# EAGLE design main (EAGLE 7.2.0)
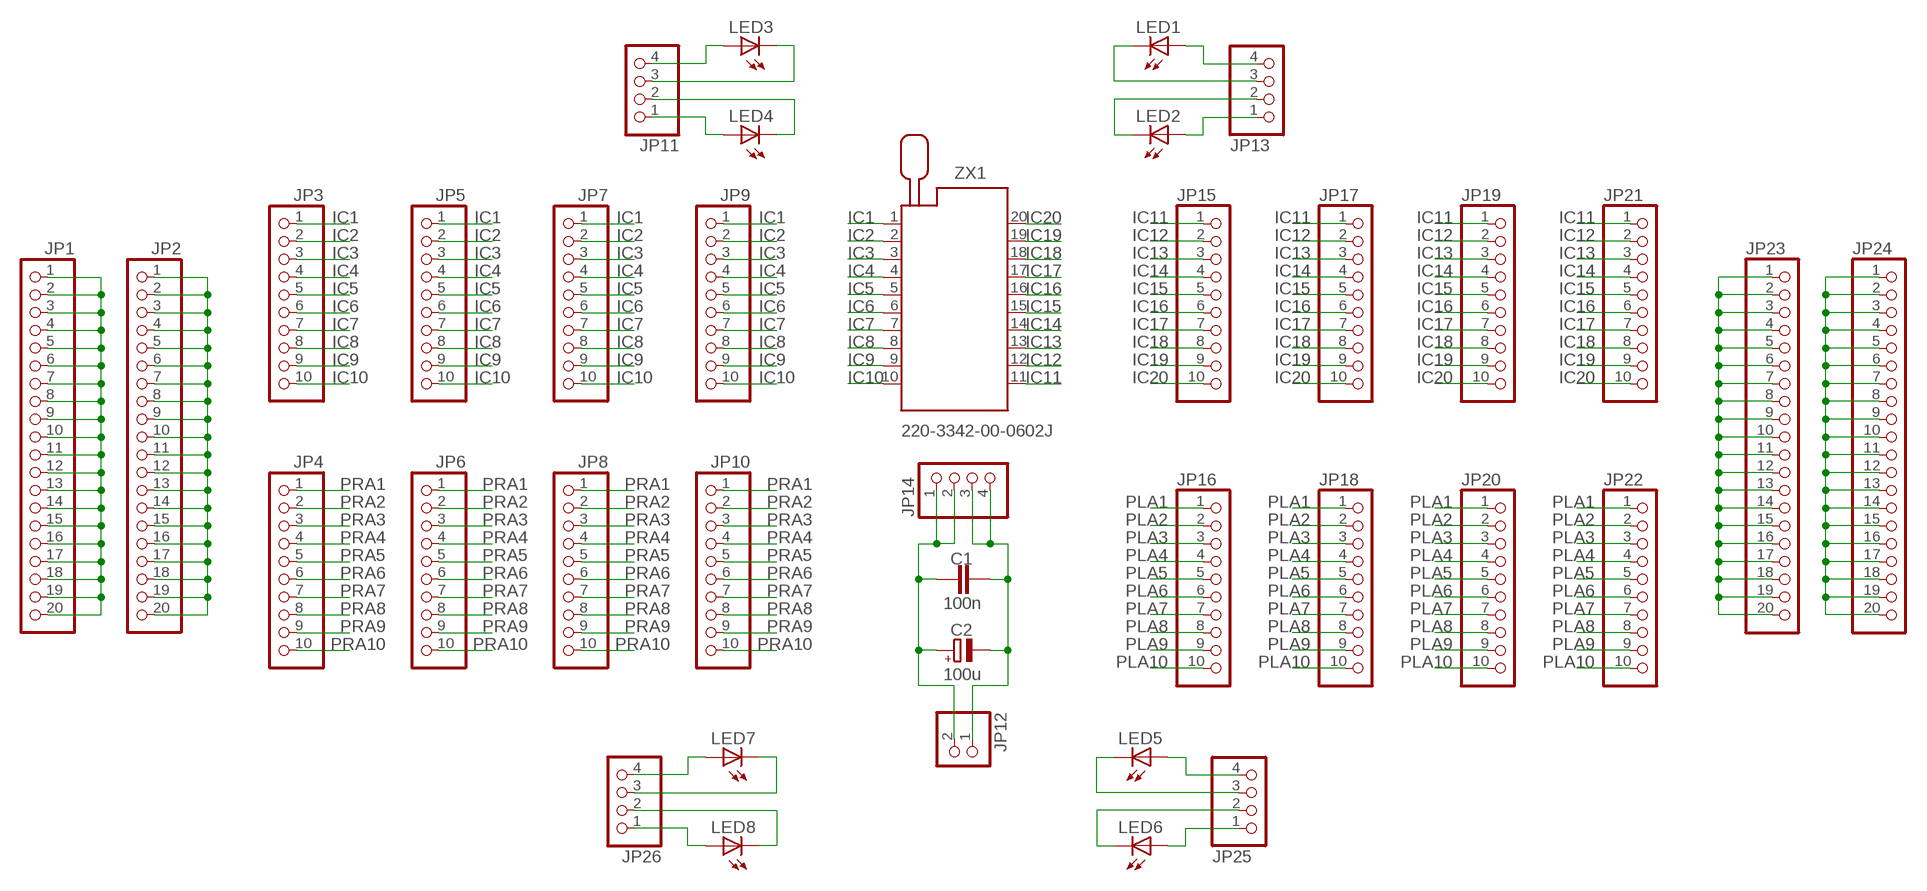
[diagram p0: schematic, sheet 1]

## Parts
C1  100n  C-EUC1206  [C1206]
C2  100u  CPOL-EUSMCA  [SMC_A]
JP1  PINHD-1X20  [1X20]
JP2  PINHD-1X20  [1X20]
JP3  PINHD-1X10  [1X10]
JP4  PINHD-1X10  [1X10]
JP5  PINHD-1X10  [1X10]
JP6  PINHD-1X10  [1X10]
JP7  PINHD-1X10  [1X10]
JP8  PINHD-1X10  [1X10]
JP9  PINHD-1X10  [1X10]
JP10  PINHD-1X10  [1X10]
JP11  PINHD-1X4  [1X04]
JP12  PINHD-1X2/90  [1X02/90]
JP13  PINHD-1X4  [1X04]
JP14  PINHD-1X4  [1X04]
JP15  PINHD-1X10  [1X10]
JP16  PINHD-1X10  [1X10]
JP17  PINHD-1X10  [1X10]
JP18  PINHD-1X10  [1X10]
JP19  PINHD-1X10  [1X10]
JP20  PINHD-1X10  [1X10]
JP21  PINHD-1X10  [1X10]
JP22  PINHD-1X10  [1X10]
JP23  PINHD-1X20  [1X20]
JP24  PINHD-1X20  [1X20]
JP25  PINHD-1X4  [1X04]
JP26  PINHD-1X4  [1X04]
LED1  LEDSFH482  [SFH482]
LED2  LEDSFH482  [SFH482]
LED3  LEDSFH482  [SFH482]
LED4  LEDSFH482  [SFH482]
LED5  LEDSFH482  [SFH482]
LED6  LEDSFH482  [SFH482]
LED7  LEDSFH482  [SFH482]
LED8  LEDSFH482  [SFH482]
ZX1  220-3342-00-0602J  [220-3342-00-0602J]

## Nets
GND: C1.2 C2.- JP12.1 JP14.3 JP14.4
IC1: JP3.1 JP5.1 JP7.1 JP9.1 ZX1.1
IC2: JP3.2 JP5.2 JP7.2 JP9.2 ZX1.2
IC3: JP3.3 JP5.3 JP7.3 JP9.3 ZX1.3
IC4: JP3.4 JP5.4 JP7.4 JP9.4 ZX1.4
IC5: JP3.5 JP5.5 JP7.5 JP9.5 ZX1.5
IC6: JP3.6 JP5.6 JP7.6 JP9.6 ZX1.6
IC7: JP3.7 JP5.7 JP7.7 JP9.7 ZX1.7
IC8: JP3.8 JP5.8 JP7.8 JP9.8 ZX1.8
IC9: JP3.9 JP5.9 JP7.9 JP9.9 ZX1.9
IC10: JP3.10 JP5.10 JP7.10 JP9.10 ZX1.10
IC11: JP15.1 JP17.1 JP19.1 JP21.1 ZX1.11
IC12: JP15.2 JP17.2 JP19.2 JP21.2 ZX1.12
IC13: JP15.3 JP17.3 JP19.3 JP21.3 ZX1.13
IC14: JP15.4 JP17.4 JP19.4 JP21.4 ZX1.14
IC15: JP15.5 JP17.5 JP19.5 JP21.5 ZX1.15
IC16: JP15.6 JP17.6 JP19.6 JP21.6 ZX1.16
IC17: JP15.7 JP17.7 JP19.7 JP21.7 ZX1.17
IC18: JP15.8 JP17.8 JP19.8 JP21.8 ZX1.18
IC19: JP15.9 JP17.9 JP19.9 JP21.9 ZX1.19
IC20: JP15.10 JP17.10 JP19.10 JP21.10 ZX1.20
N$1: JP1.1 JP1.2 JP1.3 JP1.4 JP1.5 JP1.6 JP1.7 JP1.8 JP1.9 JP1.10 JP1.11 JP1.12 JP1.13 JP1.14 JP1.15 JP1.16 JP1.17 JP1.18 JP1.19 JP1.20
N$2: JP2.1 JP2.2 JP2.3 JP2.4 JP2.5 JP2.6 JP2.7 JP2.8 JP2.9 JP2.10 JP2.11 JP2.12 JP2.13 JP2.14 JP2.15 JP2.16 JP2.17 JP2.18 JP2.19 JP2.20
N$3: JP24.1 JP24.2 JP24.3 JP24.4 JP24.5 JP24.6 JP24.7 JP24.8 JP24.9 JP24.10 JP24.11 JP24.12 JP24.13 JP24.14 JP24.15 JP24.16 JP24.17 JP24.18 JP24.19 JP24.20
N$4: JP23.1 JP23.2 JP23.3 JP23.4 JP23.5 JP23.6 JP23.7 JP23.8 JP23.9 JP23.10 JP23.11 JP23.12 JP23.13 JP23.14 JP23.15 JP23.16 JP23.17 JP23.18 JP23.19 JP23.20
N$5: JP13.3 LED1.K(C)
N$6: JP13.4 LED1.A
N$7: JP13.2 LED2.K(C)
N$8: JP13.1 LED2.A
N$9: JP11.3 LED3.K(C)
N$10: JP11.4 LED3.A
N$11: JP11.2 LED4.K(C)
N$12: JP11.1 LED4.A
N$14: JP25.3 LED5.K(C)
N$16: JP25.4 LED5.A
N$17: JP25.2 LED6.K(C)
N$18: JP25.1 LED6.A
N$19: JP26.3 LED7.K(C)
N$20: JP26.4 LED7.A
N$21: JP26.2 LED8.K(C)
N$22: JP26.1 LED8.A
PLA1: JP16.1 JP18.1 JP20.1 JP22.1
PLA2: JP16.2 JP18.2 JP20.2 JP22.2
PLA3: JP16.3 JP18.3 JP20.3 JP22.3
PLA4: JP16.4 JP18.4 JP20.4 JP22.4
PLA5: JP16.5 JP18.5 JP20.5 JP22.5
PLA6: JP16.6 JP18.6 JP20.6 JP22.6
PLA7: JP16.7 JP18.7 JP20.7 JP22.7
PLA8: JP16.8 JP18.8 JP20.8 JP22.8
PLA9: JP16.9 JP18.9 JP20.9 JP22.9
PLA10: JP16.10 JP18.10 JP20.10 JP22.10
PRA1: JP4.1 JP6.1 JP8.1 JP10.1
PRA2: JP4.2 JP6.2 JP8.2 JP10.2
PRA3: JP4.3 JP6.3 JP8.3 JP10.3
PRA4: JP4.4 JP6.4 JP8.4 JP10.4
PRA5: JP4.5 JP6.5 JP8.5 JP10.5
PRA6: JP4.6 JP6.6 JP8.6 JP10.6
PRA7: JP4.7 JP6.7 JP8.7 JP10.7
PRA8: JP4.8 JP6.8 JP8.8 JP10.8
PRA9: JP4.9 JP6.9 JP8.9 JP10.9
PRA10: JP4.10 JP6.10 JP8.10 JP10.10
VCC: C1.1 C2.+ JP12.2 JP14.1 JP14.2

## Library data of the parts
C1 = resistor:C-EU: CAPACITOR, European symbol
C2 = resistor:CPOL-EU: POLARIZED CAPACITOR, European symbol
JP1 JP2 JP23 JP24 = pinhead:PINHD-1X20: PIN HEADER
JP3-JP10 JP15-JP22 = pinhead:PINHD-1X10: PIN HEADER
JP11 JP13 JP14 JP25 JP26 = pinhead:PINHD-1X4: PIN HEADER
JP12 = pinhead:PINHD-1X2: PIN HEADER
LED1-LED8 = led:LED: LED OSRAM: - CHIPLED LG R971, LG N971, LY N971, LG Q971, LY Q971, LO R971, LY R971 LH N974, LH R974 LS Q976, LO Q976, LY Q976 LO Q996 - Hyper CHIPLED LW Q18S LB Q993, LB Q99A, LB R99A - SideLED LS A670, LO A670, LY A670, LG A670, LP A670 LB A673, LV A673, LT A673, LW A673 LH A674 LY A675 LS A676, LA A676, LO A676, LY A676, LW A676 LS A679, LY A679, LG A679 - Hyper Micro SIDELED® LS Y876, LA Y876, LO Y876, LY Y876 LT Y87S - SmartLED LW L88C, LW L88S LB L89C, LB L89S, LG L890 LS L89K, LO L89K, LY L89K LS L896, LA L896, LO L896, LY L896 - TOPLED LS T670, LO T670, LY T670, LG T670, LP T670 LSG T670, LSP T670, LSY T670, LOP T670, LYG T670 LG T671, LOG T671, LSG T671 LB T673, LV T673, LT T673, LW T673 LH T674 LS T676, LA T676, LO T676, LY T676, LB T676, LH T676, LSB T676, LW T676 LB T67C, LV T67C, LT T67C, LS T67K, LO T67K, LY T67K, LW E67C LS E67B, LA E67B, LO E67B, LY E67B, LB E67C, LV E67C, LT E67C LW T67C LS T679, LY T679, LG T679 LS T770, LO T770, LY T770, LG T770, LP T770 LB T773, LV T773, LT T773, LW T773 LH T774 LS E675, LA E675, LY E675, LS T675 LS T776, LA T776, LO T776, LY T776, LB T776 LHGB T686 LT T68C, LB T68C - Hyper Mini TOPLED® LB M676 - Mini TOPLED Santana® LG M470 LS M47K, LO M47K, LY M47K Source: http://www.osram.convergy.de LUXEON: - LUMILED® LXK2-PW12-R00, LXK2-PW12-S00, LXK2-PW14-U00, LXK2-PW14-V00 LXK2-PM12-R00, LXK2-PM12-S00, LXK2-PM14-U00 LXK2-PE12-Q00, LXK2-PE12-R00, LXK2-PE12-S00, LXK2-PE14-T00, LXK2-PE14-U00 LXK2-PB12-K00, LXK2-PB12-L00, LXK2-PB12-M00, LXK2-PB14-N00, LXK2-PB14-P00, LXK2-PB14-Q00 LXK2-PR12-L00, LXK2-PR12-M00, LXK2-PR14-Q00, LXK2-PR14-R00 LXK2-PD12-Q00, LXK2-PD12-R00, LXK2-PD12-S00 LXK2-PH12-R00, LXK2-PH12-S00 LXK2-PL12-P00, LXK2-PL12-Q00, LXK2-PL12-R00 Source: www.luxeon.com KINGBRIGHT: KA-3528ASYC Source: www.kingbright.com
ZX1 = con-3m:220-3342-00-0602J: Zero Insertion Force Socked Source: http://www.3M.com/ehpd; MF: 3M; MPN: 220-3342-00-0602J; OC_FARNELL: 9897445; OC_NEWARK: 85K7807

## Board
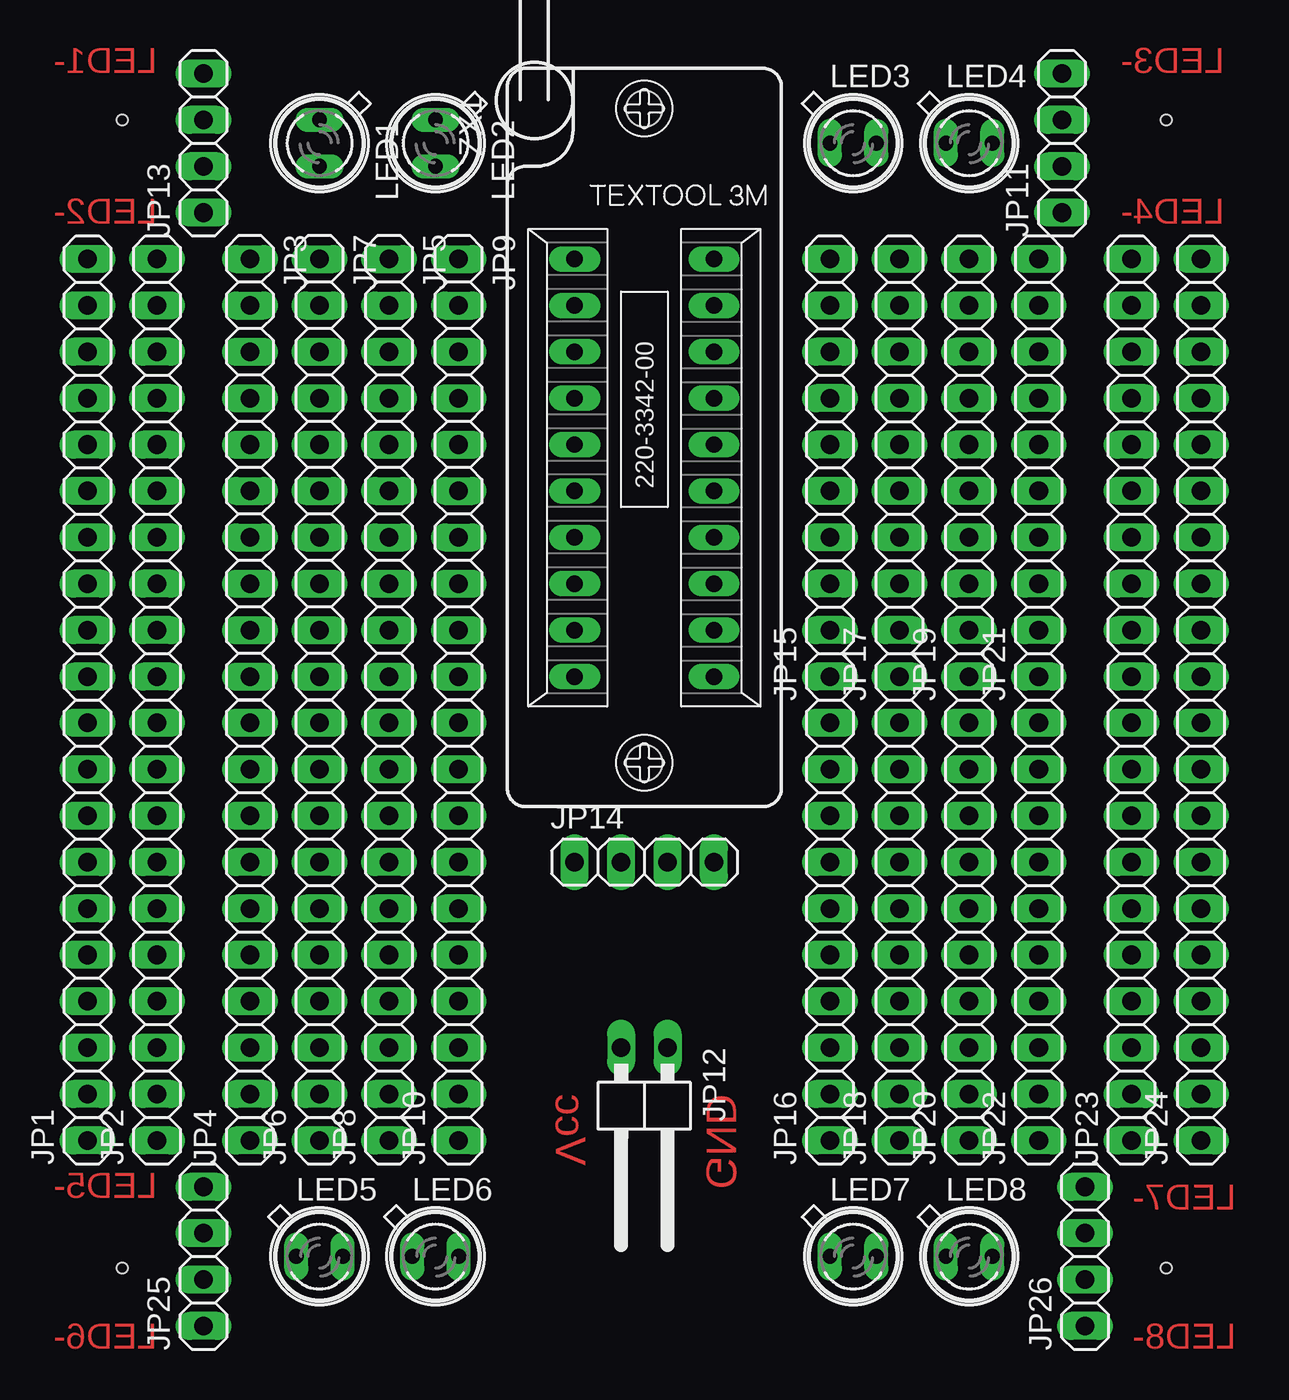
[diagram p1: board, top side]
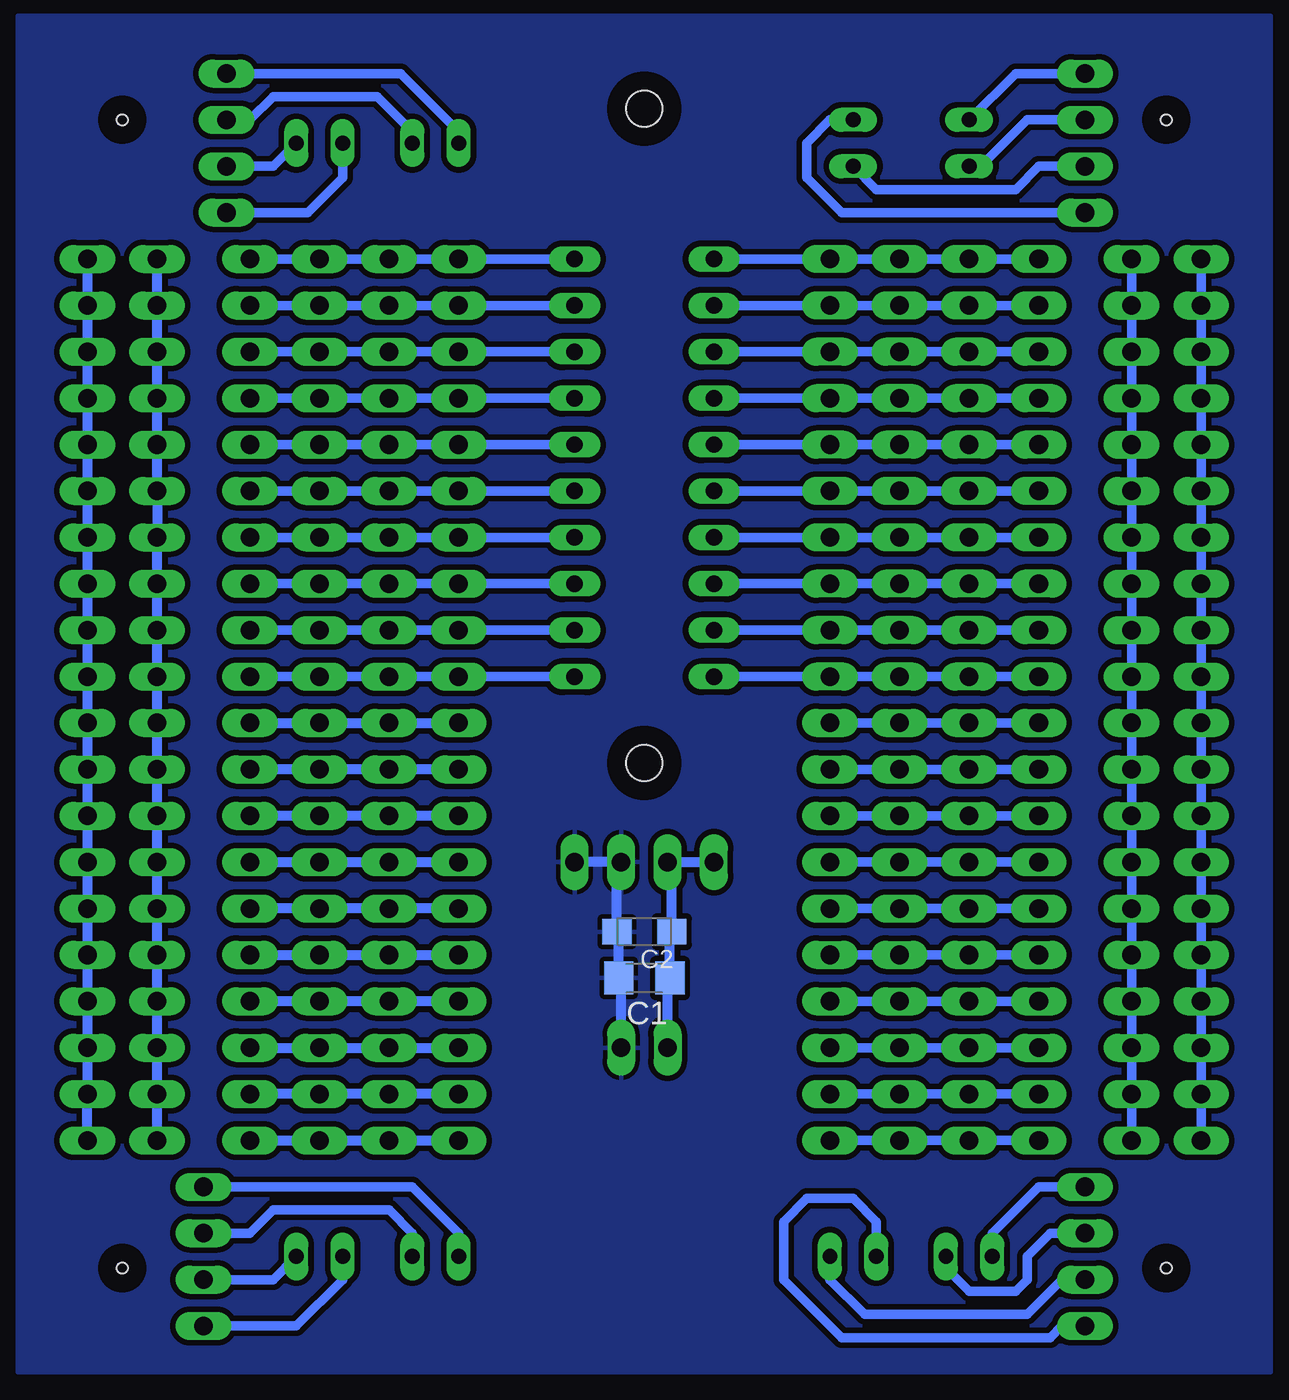
[diagram p2: board, bottom side, seen from below]

No outline drawn. Coordinates in mm, seen from the top.
Copper layers (1*16): Top 0.035mm / dielectric 1.5mm / Bottom 0.035mm
Design rules "default *": minimum track width 10mil, minimum drill 24mil, track to track 12mil, track to pad 10mil, pad to pad 8mil, via to via 8mil, smd to smd 8mil, copper to edge 40mil, drill to drill 8mil, minimum pad ring 10mil, minimum via ring 8mil, stop-mask expansion 4mil, vias tented up to drill 0mil, thermal gap 10mil
Holes 0.6 mm at 5.71,68.58 62.87,68.58 62.87,5.71 5.71,5.71

### Footprints (pad centres in the part's own frame; a part is rotated, then mirrored left to right if it is on the bottom)
C1206 = smd 1.6 x 1.8: 1 -1.4,0; 2 1.4,0
SMC_A = smd 1.6 x 1.4: + -1.5,0; - 1.5,0
1X20 = drill 1.016 long: 1 -24.13,0; 2 -21.59,0; 3 -19.05,0; 4 -16.51,0; 5 -13.97,0; 6 -11.43,0; 7 -8.89,0; 8 -6.35,0; 9 -3.81,0; 10 -1.27,0; 11 1.27,0; 12 3.81,0; 13 6.35,0; 14 8.89,0; 15 11.43,0; 16 13.97,0; 17 16.51,0; 18 19.05,0; 19 21.59,0; 20 24.13,0
1X10 = drill 1.016 long: 1 -11.43,0; 2 -8.89,0; 3 -6.35,0; 4 -3.81,0; 5 -1.27,0; 6 1.27,0; 7 3.81,0; 8 6.35,0; 9 8.89,0; 10 11.43,0
1X04 = drill 1.016 long: 1 -3.81,0; 2 -1.27,0; 3 1.27,0; 4 3.81,0
1X02/90 = drill 1.016 long: 1 -1.27,-3.81; 2 1.27,-3.81
SFH482 = drill 0.813 long: A -1.27,0; K 1.27,0
220-3342-00-0602J = drill 0.9 long: 1 -11.43,-3.81; 2 -8.89,-3.81; 3 -6.35,-3.81; 4 -3.81,-3.81; 5 -1.27,-3.81; 6 1.27,-3.81; 7 3.81,-3.81; 8 6.35,-3.81; 9 8.89,-3.81; 10 11.43,-3.81; 11 11.43,3.81; 12 8.89,3.81; 13 6.35,3.81; 14 3.81,3.81; 15 1.27,3.81; 16 -1.27,3.81; 17 -3.81,3.81; 18 -6.35,3.81; 19 -8.89,3.81; 20 -11.43,3.81 | hole 2: 16.16,0; -19.66,0

### Placement (x,y rotation side)
C1  34.29,21.59 180 bottom
C2  34.29,24.13 180 bottom
JP1  3.81,36.83 90 top
JP2  7.62,36.83 90 top
JP3  12.7,49.53 270 top
JP4  12.7,24.13 90 top
JP5  20.32,49.53 270 top
JP6  16.51,24.13 90 top
JP7  16.51,49.53 270 top
JP8  20.32,24.13 90 top
JP9  24.13,49.53 270 top
JP10  24.13,24.13 90 top
JP11  57.15,67.31 90 top
JP12  34.29,13.97 180 top
JP13  10.16,67.31 90 top
JP14  34.29,27.94 0 top
JP15  44.45,49.53 90 top
JP16  44.45,24.13 90 top
JP17  48.26,49.53 90 top
JP18  48.26,24.13 90 top
JP19  52.07,49.53 90 top
JP20  52.07,24.13 90 top
JP21  55.88,49.53 90 top
JP22  55.88,24.13 90 top
JP23  60.96,36.83 90 top
JP24  64.77,36.83 90 top
JP25  10.16,6.35 90 top
JP26  58.42,6.35 90 top
LED1  16.51,67.31 270 top
LED2  22.86,67.31 270 top
LED3  45.72,67.31 0 top
LED4  52.07,67.31 0 top
LED5  16.51,6.35 0 top
LED6  22.86,6.35 0 top
LED7  45.72,6.35 0 top
LED8  52.07,6.35 0 top
ZX1  34.29,49.53 270 top

### Tracks (layer width: path | path; a pad name or v marks a point on that pad's centre or on a via)
GND
  Bottom 0.559: JP12.1 35.56,21.46 C1.2 35.69,24.03 C2.- 35.79,27.71 JP14.3 JP14.4
  pour Bottom: 0,0 0,74.3 68.58,74.3 68.58,0
IC1
  Bottom 0.508: JP3.1 JP7.1 JP5.1 JP9.1 ZX1.1
IC2
  Bottom 0.508: ZX1.2 JP9.2 JP5.2 JP7.2 JP3.2
IC3
  Bottom 0.508: JP3.3 JP7.3 JP5.3 JP9.3 ZX1.3
IC4
  Bottom 0.508: ZX1.4 JP9.4 JP5.4 JP7.4 JP3.4
IC5
  Bottom 0.508: ZX1.5 JP9.5 JP5.5 JP7.5 JP3.5
IC6
  Bottom 0.508: ZX1.6 JP9.6 JP5.6 JP7.6 JP3.6
IC7
  Bottom 0.508: JP3.7 JP7.7 JP5.7 JP9.7 ZX1.7
IC8
  Bottom 0.508: JP3.8 JP7.8 JP5.8 JP9.8 ZX1.8
IC9
  Bottom 0.508: ZX1.9 JP9.9 JP5.9 JP7.9 JP3.9
IC10
  Bottom 0.508: JP3.10 JP7.10 JP5.10 JP9.10 ZX1.10
IC11
  Bottom 0.508: JP21.1 JP19.1 JP17.1 JP15.1 ZX1.11
IC12
  Bottom 0.508: ZX1.12 JP15.2 JP17.2 JP19.2 JP21.2
IC13
  Bottom 0.508: JP21.3 JP19.3 JP17.3 JP15.3 ZX1.13
IC14
  Bottom 0.508: JP21.4 JP19.4 JP17.4 JP15.4 ZX1.14
IC15
  Bottom 0.508: ZX1.15 JP15.5 JP17.5 JP19.5 JP21.5
IC16
  Bottom 0.508: ZX1.16 JP15.6 JP17.6 JP19.6 JP21.6
IC17
  Bottom 0.508: ZX1.17 JP15.7 JP17.7 JP19.7 JP21.7
IC18
  Bottom 0.508: ZX1.18 JP15.8 JP17.8 JP19.8 JP21.8
IC19
  Bottom 0.508: ZX1.19 JP15.9 JP17.9 JP19.9 JP21.9
IC20
  Bottom 0.508: ZX1.20 JP15.10 JP17.10 JP19.10 JP21.10
N$1
  Bottom 0.508: JP1.1 JP1.2 JP1.3 JP1.4 JP1.5 JP1.6 JP1.7 JP1.8 JP1.9 JP1.10 JP1.11 JP1.12 JP1.13 JP1.14 JP1.15 JP1.16 JP1.17 JP1.18 JP1.19 JP1.20
N$2
  Bottom 0.508: JP2.1 JP2.2 JP2.3 JP2.4 JP2.5 JP2.6 JP2.7 JP2.8 JP2.9 JP2.10 JP2.11 JP2.12 JP2.13 JP2.14 JP2.15 JP2.16 JP2.17 JP2.18 JP2.19 JP2.20
N$3
  Bottom 0.559: JP24.20 JP24.19 JP24.18 JP24.17 JP24.16 JP24.15 JP24.14 JP24.13 JP24.12 JP24.11 JP24.10 JP24.9 JP24.8 JP24.7 JP24.6 JP24.5 JP24.4 JP24.3 JP24.2 JP24.1
N$4
  Bottom 0.559: JP23.1 JP23.2 JP23.3 JP23.4 JP23.5 JP23.6 JP23.7 JP23.8 JP23.9 JP23.10 JP23.11 JP23.12 JP23.13 JP23.14 JP23.15 JP23.16 JP23.17 JP23.18 JP23.19 JP23.20
N$5
  Bottom 0.508: JP13.3 13.34,68.58 15.88,66.04 LED1.K
N$6
  Bottom 0.508: JP13.4 13.97,71.12 LED1.A
N$7
  Bottom 0.508: JP13.2 12.7,66.04 13.97,64.77 21.59,64.77 LED2.K
N$8
  Bottom 0.508: JP13.1 23.5,63.5 25.4,65.41 25.4,67.31 24.13,68.58 LED2.A
N$9
  Bottom 0.508: JP11.3 55.88,68.58 54.61,69.85 48.9,69.85 46.99,67.94 LED3.K
N$10
  Bottom 0.508: JP11.4 47.62,71.12 44.45,67.94 LED3.A
N$11
  Bottom 0.508: JP11.2 54.61,66.04 LED4.K
N$12
  Bottom 0.508: JP11.1 52.7,63.5 50.8,65.41 LED4.A
N$14
  Bottom 0.508: JP25.3 12.06,7.62 13.34,6.35 13.34,5.08 13.97,4.45 16.51,4.45 17.78,5.71 LED5.K
N$16
  Bottom 0.508: JP25.4 12.7,10.16 15.24,7.62 LED5.A
N$17
  Bottom 0.508: JP25.2 11.43,5.08 13.34,3.17 22.23,3.17 24.13,5.08 LED6.K
N$18
  Bottom 0.508: JP25.1 11.43,2.54 12.06,1.91 23.5,1.91 26.67,5.08 26.67,8.26 25.4,9.53 22.86,9.53 21.59,8.26 LED6.A
N$19
  Bottom 0.508: JP26.3 55.88,7.62 54.61,8.89 48.26,8.89 46.99,7.62 LED7.K
N$20
  Bottom 0.508: JP26.4 46.99,10.16 44.45,7.62 LED7.A
N$21
  Bottom 0.508: JP26.2 54.61,5.08 LED8.K
N$22
  Bottom 0.508: JP26.1 53.34,2.54 50.8,5.08 LED8.A
PLA1
  Bottom 0.559: JP22.1 JP20.1 JP18.1 JP16.1
PLA2
  Bottom 0.559: JP16.2 JP18.2 JP20.2 JP22.2
PLA3
  Bottom 0.559: JP22.3 JP20.3 JP18.3 JP16.3
PLA4
  Bottom 0.559: JP16.4 JP18.4 JP20.4 JP22.4
PLA5
  Bottom 0.559: JP22.5 JP20.5 JP18.5 JP16.5
PLA6
  Bottom 0.559: JP16.6 JP18.6 JP20.6 JP22.6
PLA7
  Bottom 0.559: JP22.7 JP20.7 JP18.7 JP16.7
PLA8
  Bottom 0.559: JP16.8 JP18.8 JP20.8 JP22.8
PLA9
  Bottom 0.559: JP16.9 JP18.9 JP20.9 JP22.9
PLA10
  Bottom 0.559: JP22.10 JP20.10 JP18.10 JP16.10
PRA1
  Bottom 0.508: JP4.1 JP6.1 JP8.1 JP10.1
PRA2
  Bottom 0.508: JP4.2 JP6.2 JP8.2 JP10.2
PRA3
  Bottom 0.508: JP4.3 JP6.3 JP8.3 JP10.3
PRA4
  Bottom 0.508: JP4.4 JP6.4 JP8.4 JP10.4
PRA5
  Bottom 0.508: JP4.5 JP6.5 JP8.5 JP10.5
PRA6
  Bottom 0.508: JP4.6 JP6.6 JP8.6 JP10.6
PRA7
  Bottom 0.508: JP4.7 JP6.7 JP8.7 JP10.7
PRA8
  Bottom 0.508: JP10.8 JP8.8 JP6.8 JP4.8
PRA9
  Bottom 0.508: JP4.9 JP6.9 JP8.9 JP10.9
PRA10
  Bottom 0.508: JP10.10 JP8.10 JP6.10 JP4.10
VCC
  Bottom 0.559: JP12.2 33.02,21.46 C1.1 32.89,24.03 C2.+ 32.79,27.71 JP14.2 JP14.1

### Text on the board
Top: LED1- | LED3- | LED2- | LED4- | Vcc | GND | LED5- | LED7- | LED6- | LED8-